# EAGLE schematic electricals_3.5mm_only (EAGLE 6.4)
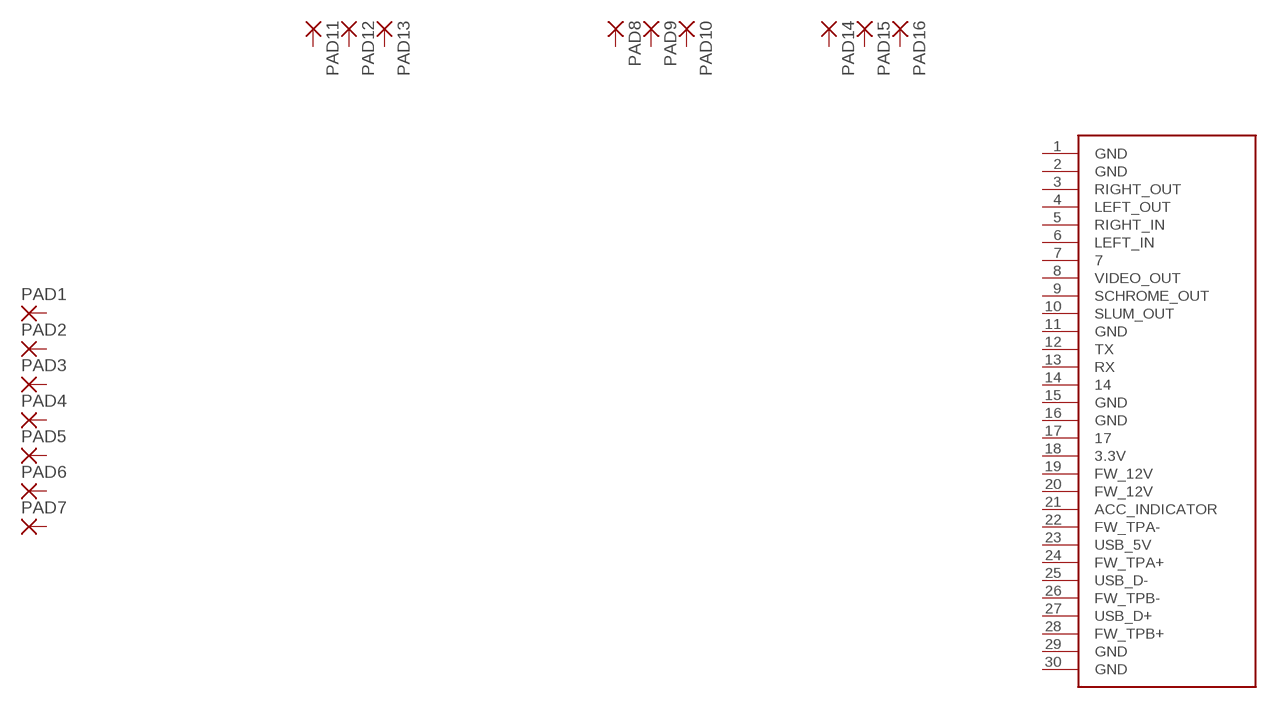
[diagram p0: schematic, sheet 1]

## Parts
PAD1  2,54/1,1  [2,54/1,1]
PAD2  2,54/1,1  [2,54/1,1]
PAD3  2,54/1,1  [2,54/1,1]
PAD4  2,54/1,1  [2,54/1,1]
PAD5  2,54/1,1  [2,54/1,1]
PAD6  2,54/1,1  [2,54/1,1]
PAD7  2,54/1,1  [2,54/1,1]
PAD8  2,54/1,1  [2,54/1,1]
PAD9  2,54/1,1  [2,54/1,1]
PAD10  2,54/1,1  [2,54/1,1]
PAD11  2,54/1,1  [2,54/1,1]
PAD12  2,54/1,1  [2,54/1,1]
PAD13  2,54/1,1  [2,54/1,1]
PAD14  2,54/1,1  [2,54/1,1]
PAD15  2,54/1,1  [2,54/1,1]
PAD16  2,54/1,1  [2,54/1,1]
U$1  IPOD_CONNECTOR_MALE  [IPOD_MALE_CONNECTOR]
Unconnected: PAD1.1(P) PAD2.1(P) PAD3.1(P) PAD4.1(P) PAD5.1(P) PAD6.1(P) PAD7.1(P) PAD8.1(P) PAD9.1(P) PAD10.1(P) PAD11.1(P) PAD12.1(P) PAD13.1(P) PAD14.1(P) PAD15.1(P) PAD16.1(P) U$1.1(GND) U$1.2(GND) U$1.3(RIGHT_OUT) U$1.4(LEFT_OUT) U$1.5(RIGHT_IN) U$1.6(LEFT_IN) U$1.7 U$1.8(VIDEO_OUT) U$1.9(SCHROME_OUT) U$1.10(SLUM_OUT) U$1.11(GND) U$1.12(TX) U$1.13(RX) U$1.14 U$1.15(GND) U$1.16(GND) U$1.17 U$1.18(3.3V) U$1.19(FW_12V) U$1.20(FW_12V) U$1.21(ACC_INDICATOR) U$1.22(FW_TPA-) U$1.23(USB_5V) U$1.24(FW_TPA+) U$1.25(USB_D-) U$1.26(FW_TPB-) U$1.27(USB_D+) U$1.28(FW_TPB+) U$1.29(GND) U$1.30(GND)

## Library data of the parts
PAD1-PAD16 = wirepad:2,54/1,1: THROUGH-HOLE PAD
U$1 = SparkFun:IPOD_CONNECTOR_MALE: iPod Male Connector This is the connector that will insert into an iPods. Use this connector to gain access to the various iPod pins. Schematic and footprint are not yet production proven. The PCB thickness must be more thin than the standard 0.062" FR4. Spark Fun Electronics SKU : DEV-00633